# EAGLE design at86rf231-2 (EAGLE 5.06)
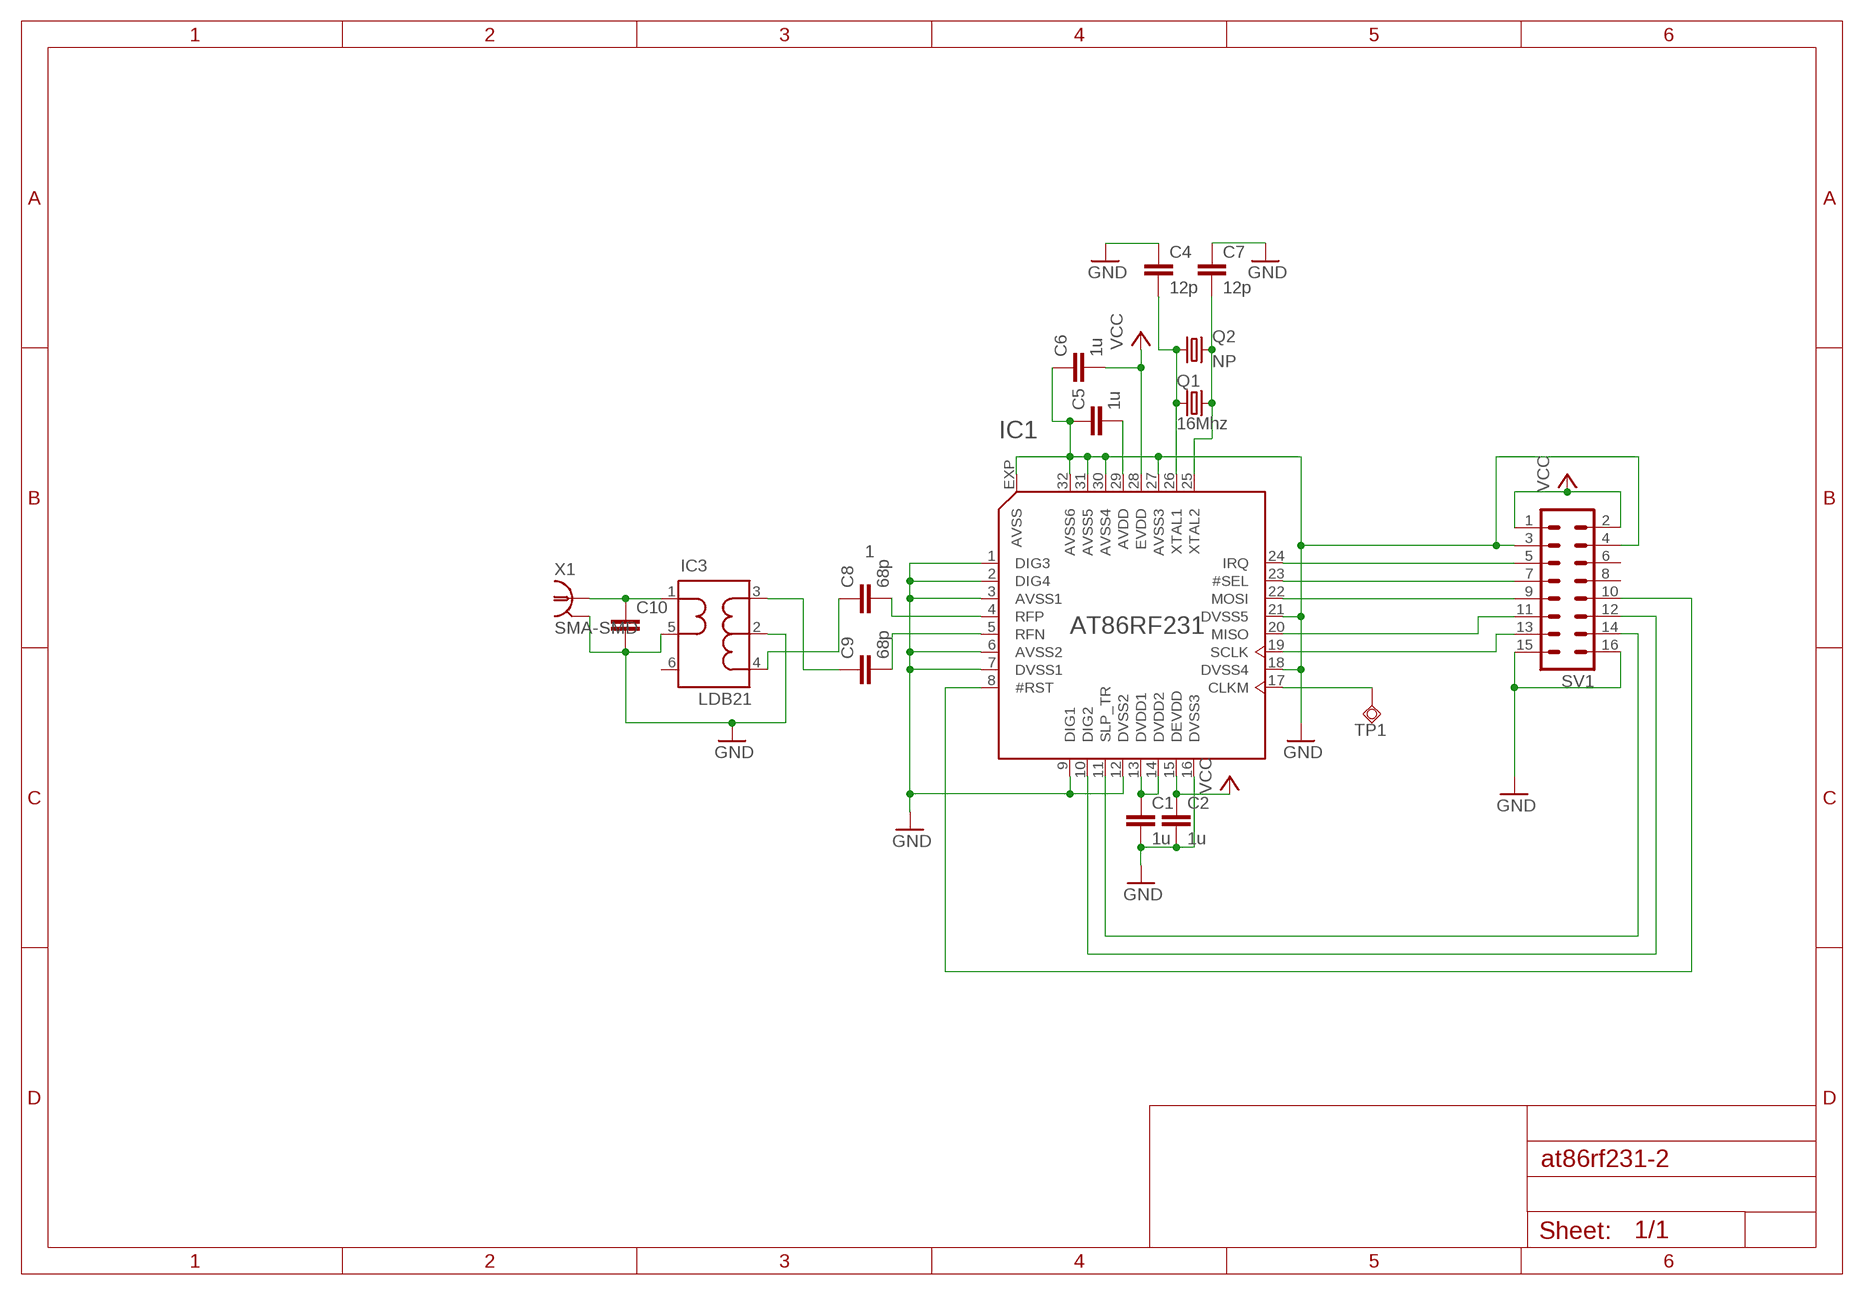
[diagram p0: schematic, sheet 1]

## Parts
C1  1u  C-EUC0805  [C0805]
C2  1u  C-EUC0805  [C0805]
C4  12p  C-EUC0805  [C0805]
C5  1u  C-EUC0805  [C0805]
C6  1u  C-EUC0805  [C0805]
C7  12p  C-EUC0805  [C0805]
C8  68p  C-EUC0603  [C0603]
C9  68p  C-EUC0603  [C0603]
C10  C-EUC0603  [C0603]
IC1  AT86RF231  [QFN32]
IC3  LDB21  [DIL-6]
Q1  16Mhz  KX-8  [KX-8]
Q2  NP  CRYSTALSM49  [SM49]
SV1  MA08-2  [MA08-2]
TP1  TPSQB1,27  [B1,27]
X1  SMA-SMD  [SMA-SMD]

## Nets
AVDD: C5.2 IC1.29(AVDD)
CS1: IC1.23(#SEL) SV1.7
DIG2: IC1.10(DIG2) SV1.12
DVDD1: C1.1 IC1.13(DVDD1) IC1.14(DVDD2)
GND: C1.2 C2.2 C4.1 C5.1 C6.1 C7.1 C10.2 IC1.1(DIG3) IC1.2(DIG4) IC1.3(AVSS1) IC1.6(AVSS2) IC1.7(DVSS1) IC1.9(DIG1) IC1.12(DVSS2) IC1.16(DVSS3) IC1.18(DVSS4) IC1.21(DVSS5) IC1.27(AVSS3) IC1.30(AVSS4) IC1.31(AVSS5) IC1.32(AVSS6) IC1.EXP(AVSS) IC3.2(GND2) IC3.5(GND5) SV1.3 SV1.4 SV1.15 SV1.16 X1.2@1(GND)
IRQ: IC1.24(IRQ) SV1.5
N$2: IC1.17(CLKM) TP1.PP(TP)
N$6: IC1.11(SLP_TR) SV1.14
N$9: IC1.8(#RST) SV1.10
N$10: C4.2 IC1.26(XTAL1) Q1.P1 Q2.1
N$11: C7.2 IC1.25(XTAL2) Q1.P3 Q2.2
N$16: C9.1 IC3.3(BAL3)
N$17: C8.1 IC3.4(BAL4)
N$19: C8.2 IC1.4(RFP)
N$20: C9.2 IC1.5(RFN)
N$21: C10.1 IC3.1(UNBAL) X1.1
SCLK: IC1.19(SCLK) SV1.13
SI: IC1.22(MOSI) SV1.9
SO: IC1.20(MISO) SV1.11
VCC: C2.1 C6.2 IC1.15(DEVDD) IC1.28(EVDD) SV1.1 SV1.2
Unconnected: IC3.6(NC) SV1.6 SV1.8

## Power pins joined to a net without a drawn wire
GND: Q1.P2(GND) Q1.P4(GND) X1.2@2(GND) X1.2@3(GND) X1.2@4(GND) X1.2@5(GND) X1.2@6(GND)

## Library data of the parts
C1 C2 C4-C10 = rcl:C-EU: CAPACITOR, European symbol
IC1 = at86rf231:AT86RF231
IC3 = ap_transformer:LDB21
Q1 = crystal-my:KX-8
Q2 = crystal:CRYSTAL: CRYSTAL
SV1 = con-lstb:MA08-2: PIN HEADER
TP1 = testpad:TPSQ: Test pad
X1 = con-coax:SMA-SMD: SMA 50 Ohm Straight Jack Receptacle - Surface Mount www.johnsoncomponents.com Source: http://catalog.digikey.com .. 142-0711-201, 205, 202, 206.pdf

## Net classes
0 default: width 0.3 mm, clearance 0.2 mm

## Board
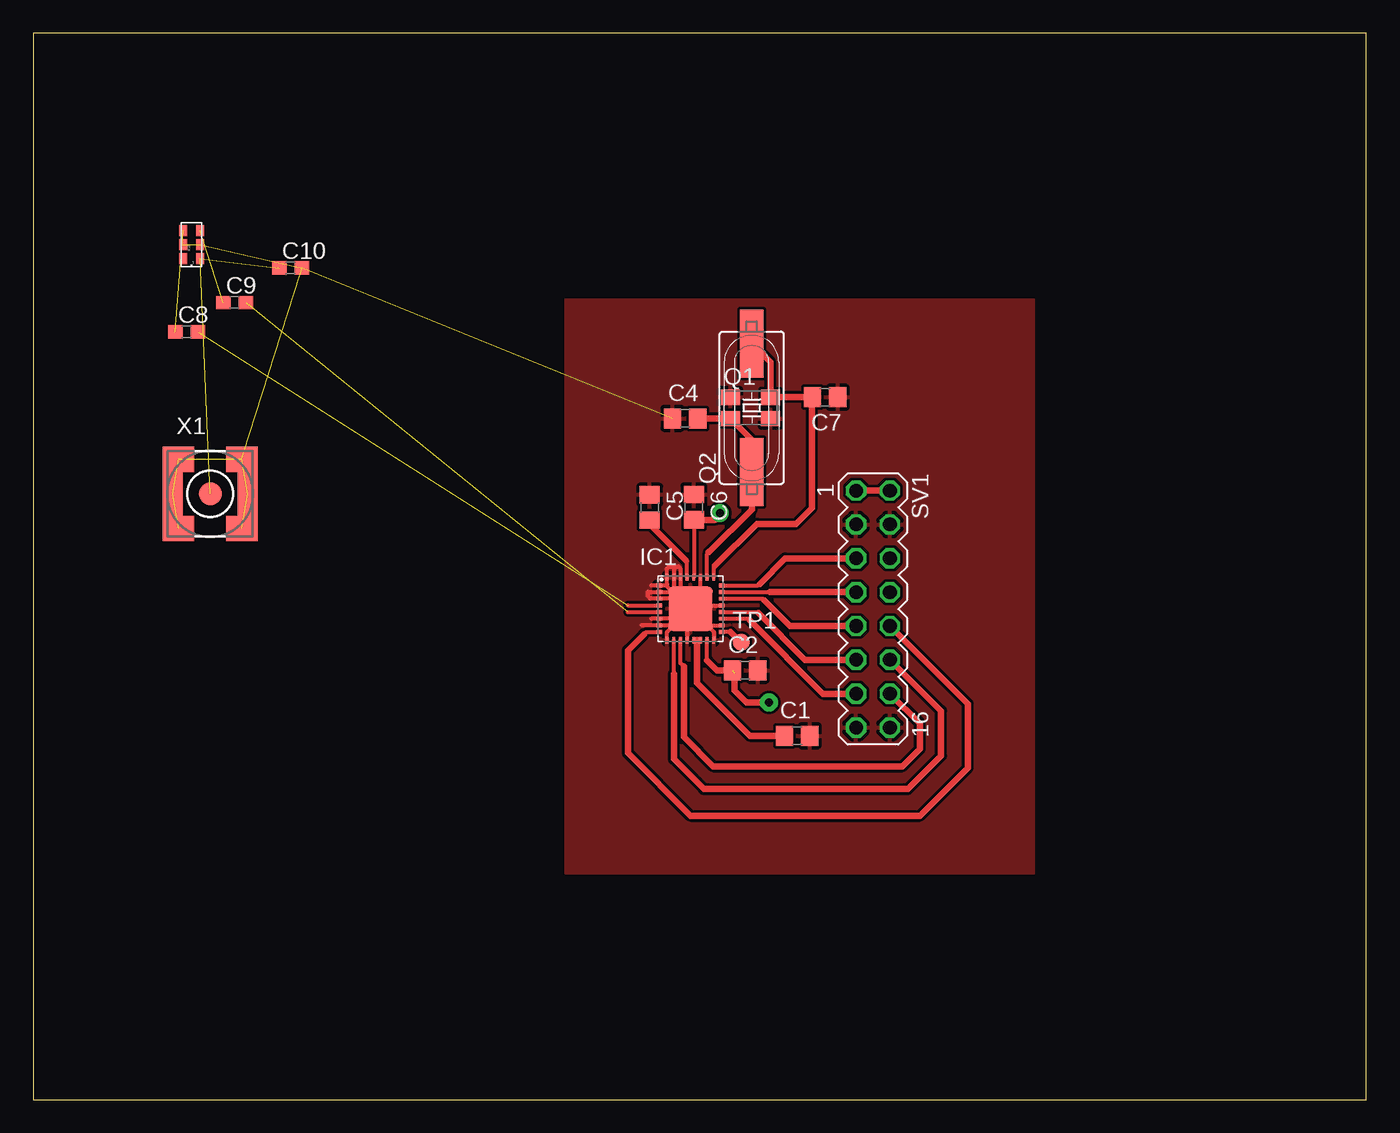
[diagram p1: board, top side]
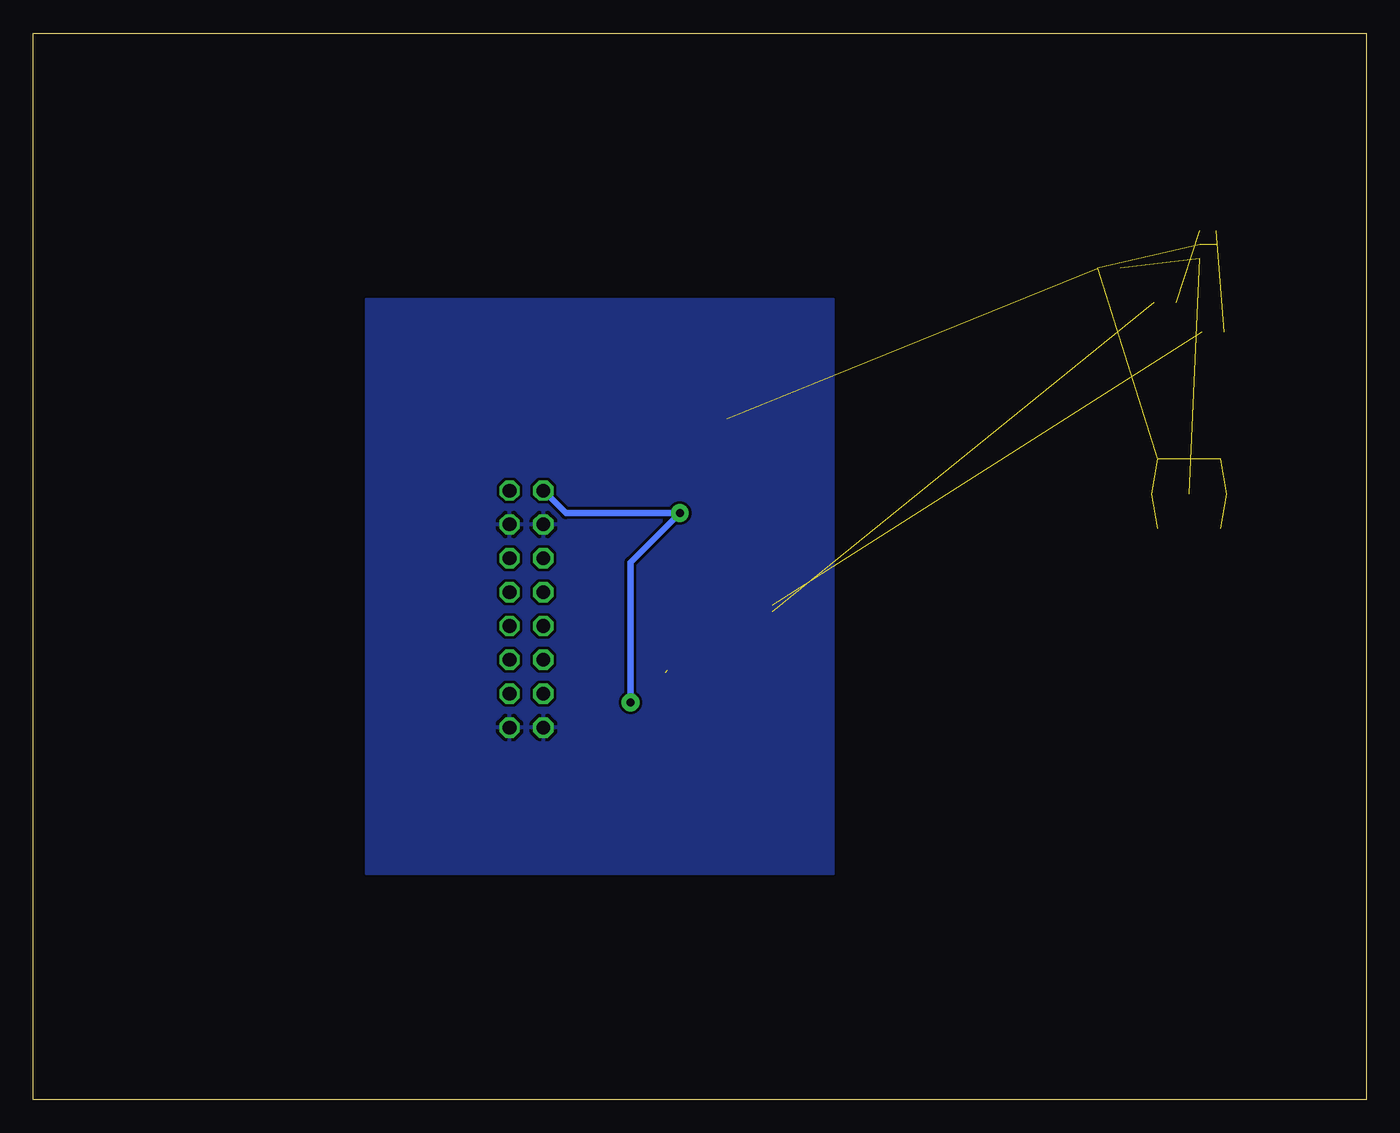
[diagram p2: board, bottom side, seen from below]

Size 100 x 80 mm. Coordinates in mm from the lower left corner, seen from the top.
Outline: 0,0 100,0 100,80 0,80 0,0
Copper layers (1*16): Top 0.018mm / dielectric 0.5mm / Bottom 0.018mm
Design rules "rezonit *": minimum track width 0.2mm, minimum drill 0.4mm, track to track 0.2mm, track to pad 0.2mm, pad to pad 0.2mm, via to via 0.3mm, smd to smd 0mil, copper to edge 40mil, drill to drill 8mil, minimum pad ring 10mil, minimum via ring 0.25mm, stop-mask expansion 4mil, vias tented up to drill 0mil, thermal gap 10mil

### Footprints (pad centres in the part's own frame; a part is rotated, then mirrored left to right if it is on the bottom)
C0805 = smd 1.3 x 1.5: 1 -0.95,0; 2 0.95,0
C0603 = smd 1.1 x 1: 1 -0.85,0; 2 0.85,0
QFN32 = smd 0.5 x 0.3: 1 -2.35,1.75; 2 -2.35,1.25; 3 -2.35,0.75; 4 -2.35,0.25; 5 -2.35,-0.25; 6 -2.35,-0.75; 7 -2.35,-1.25; 8 -2.35,-1.75; 17 2.35,-1.75; 18 2.35,-1.25; 19 2.35,-0.75; 20 2.35,-0.25; 21 2.35,0.25; 22 2.35,0.75; 23 2.35,1.25; 24 2.35,1.75 | smd 0.3 x 0.5: 9 -1.75,-2.35; 10 -1.25,-2.35; 11 -0.75,-2.35; 12 -0.25,-2.35; 13 0.25,-2.35; 14 0.75,-2.35; 15 1.25,-2.35; 16 1.75,-2.35; 25 1.75,2.35; 26 1.25,2.35; 27 0.75,2.35; 28 0.25,2.35; 29 -0.25,2.35; 30 -0.75,2.35; 31 -1.25,2.35; 32 -1.75,2.35 | smd 3.3 x 3.3: EXP 0,0
DIL-6 = smd 0.8 x 0.6: 1 -1.1,-0.6; 2 -0.05,-0.6; 3 1,-0.6; 4 1,0.65; 5 -0.05,0.65; 6 -1.1,0.65
KX-8 = smd 1.4 x 1.15: P1 -1.5,-0.8; P2 1.5,-0.8; P3 1.5,0.8; P4 -1.5,0.8
SM49 = smd 5.08 x 1.778: 1 -4.826,0; 2 4.826,0
MA08-2 = drill 1.016 octagon: 1 -8.89,-1.27; 2 -8.89,1.27; 3 -6.35,-1.27; 4 -6.35,1.27; 5 -3.81,-1.27; 6 -3.81,1.27; 7 -1.27,-1.27; 8 -1.27,1.27; 9 1.27,-1.27; 10 1.27,1.27; 11 3.81,-1.27; 12 3.81,1.27; 13 6.35,-1.27; 14 6.35,1.27; 15 8.89,-1.27; 16 8.89,1.27
B1,27 = smd 1.27 x 1.27: PP 0,0
SMA-SMD = smd 1.73 x 1.73: 1 0,0 | smd 2.35 x 1.9: 2@1 -2.375,2.6; 2@2 -2.375,-2.6; 2@3 2.375,-2.6; 2@4 2.375,2.6 | smd 1.5 x 3.4: 2@5 -2.8,0; 2@6 2.8,0

### Placement (x,y rotation side)
C1  57.3,27.3 0 top
C2  53.4,32.2 0 top
C4  48.9,51.1 0 top
C5  46.24,44.43 270 top
C6  49.55,44.44 270 top
C7  59.4,52.7 180 top
C8  11.5,57.6 0 top
C9  15.1,59.8 0 top
C10  19.3,62.4 0 top
IC1  49.3,36.83 0 top
IC3  11.9,64.2 90 top
Q1  53.8,51.9 0 top
Q2  53.9,51.9 90 top
SV1  63,36.8 270 top
TP1  53.1,34.3 0 top
X1  13.27,45.45 0 top

### Tracks (layer width: path | path; a pad name or v marks a point on that pad's centre or on a via)
AVDD
  Top 0.3: 48.94,40.48 49.05,40.37 IC1.29
  Top 0.5: 48.94,40.48 46.24,43.18 C5.2
CS1
  Top 0.3: IC1.23 55.28,38.08
  Top 0.5: 55.28,38.08 SV1.7
DIG2
  Top 0.3: 48.05,31.92 IC1.10
  Top 0.5: SV1.12 68.1,29.16 68.1,25.8 65.6,23.3 50.3,23.3 48.05,25.55 48.05,31.92
DVDD1
  Top 0.3: IC1.14 IC1.13 49.8,34.48
  Top 0.5: 49.8,34.48 49.8,31.25 53.75,27.3 C1.1
GND  (9 unrouted)
  Top 0.3: IC1.12 49.05,36.58 IC1.EXP | IC1.9 47.55,35.08 IC1.EXP | 48.05,35.58 IC1.7 | IC1.16 51.05,35.08 50.62,35.52 | IC1.EXP 50.62,35.52 | 49.3,37.08 IC1.21 | IC1.EXP 49.3,37.08 | IC1.27 50.05,37.58 IC1.EXP | IC1.EXP 48.55,36.08 46.37,36.08 | IC1.EXP 48.05,35.58 | 48.05,35.58 45.65,35.58 | 49.3,37.08 48.8,37.58 46.27,37.58 46.1,37.75 46.1,38.1 46.12,38.08 47.97,38.08 47.47,38.58 | 47.47,38.58 46.38,38.58 | 47.47,38.58 47.55,38.66 47.55,39.87 47.68,40 48,40 | 48,40 48.4,40 48.55,39.85 48.55,38.27 | 48,40 48.05,39.95 48.05,37.67 | IC1.18 50.62,35.58 50.62,35.52
  pour Bottom: 40,60 75,60 75,17 40,17
  pour Top (isolate 0.2): 40,60 75,60 75,17 40,17
IRQ
  Top 0.3: IC1.24 54.38,38.58 54.5,38.7
  Top 0.5: SV1.5 56.41,40.61 54.5,38.7
N$2
  Top 0.3: 52.32,35.08 IC1.17
  Top 0.5: TP1.PP 52.32,35.08
N$6
  Top 0.3: IC1.11 48.55,32.75 48.7,32.6 arc-90 48.8,32.5
  Top 0.5: SV1.14 66.5,28.22 66.5,26.3 65.2,25 51,25 48.8,27.2 48.8,31.5 | 48.8,31.5 48.8,32 | 48.8,31.5 48.8,32.5
N$9
  Top 0.3: IC1.8 45.98,35.08 45.8,34.9
  Top 0.5: 45.8,34.9 44.6,33.7 44.6,26 49.3,21.3 66.5,21.3 70.1,24.9 70.1,29.7 SV1.10
N$10
  Top 0.3: IC1.26 50.55,40.95 50.67,41.07
  Top 0.5: Q2.1 53.9,49.5 Q1.P1 C4.2 | Q2.1 53.23,46.4 | 50.67,41.07 50.69,41.07 53.9,44.28 Q2.1
N$11
  Top 0.3: IC1.25 51.05,39.95 51.16,40.06
  Top 0.5: Q2.2 55.3,55.33 Q1.P3 58.4,52.7 | 58.4,52.7 C7.2 | 51.16,40.06 54.3,43.2 57.2,43.2 58.4,44.4 58.4,52.7
N$16  (1 unrouted)
N$17  (1 unrouted)
N$19  (1 unrouted)
  Top 0.3: 44.6,37.08 IC1.4
N$20  (1 unrouted)
  Top 0.3: 44.6,36.58 IC1.5
N$21  (2 unrouted)
SCLK
  Top 0.3: IC1.19 53.62,36.08 53.75,35.95
  Top 0.5: 53.75,35.95 59.25,30.45 SV1.13
SI
  Top 0.3: IC1.22 54.72,37.58 54.85,37.45
  Top 0.5: 54.85,37.45 56.77,35.53 SV1.9
SO
  Top 0.3: IC1.20 54.32,36.58 54.4,36.5
  Top 0.5: 54.4,36.5 57.91,32.99 SV1.11
VCC  (via drill 0.6)  (1 unrouted)
  Top 0.3: C6.2 IC1.28 | 50.55,32.95 IC1.15
  Top 0.5: SV1.1 SV1.2 | 51.09,43.59 v51.5,44 arc-90 50.99,43.49 C6.2 | C2.1 51.3,32.2 50.55,32.95 | 52.6,32 52.6,30.7 53.5,29.8 v55.2,29.8
  Bottom 0.5: SV1.1 60.04,44 v51.5,44 55.2,40.3 v55.2,29.8